# Altium schematic sheet UWB_F4_CAN_UWB_layout_R2.SchDoc
size A4; DrawnBy: Philip Rowse
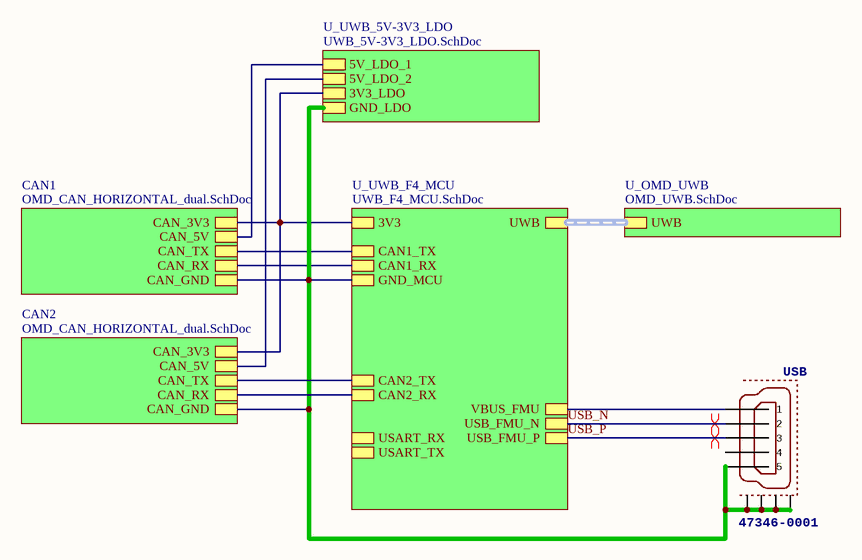
[diagram p0: UWB_F4_CAN_UWB_layout_R2.SchDoc]

## Parts
USB  47346-0001  [MOLEX-47346-0001]

## Sub-sheets
CAN1 = OMD_CAN_HORIZONTAL_dual.SchDoc: CAN_RX, CAN_TX, CAN_5V, CAN_GND, CAN_3V3
CAN2 = OMD_CAN_HORIZONTAL_dual.SchDoc: CAN_RX, CAN_TX, CAN_5V, CAN_GND, CAN_3V3
U_OMD_UWB = OMD_UWB.SchDoc: UWB (harness UWB)
U_UWB_5V-3V3_LDO = UWB_5V-3V3_LDO.SchDoc: 3V3_LDO, GND_LDO, 5V_LDO_2, 5V_LDO_1
U_UWB_F4_MCU = UWB_F4_MCU.SchDoc: GND_MCU, UWB (harness UWB), 3V3, CAN1_TX, CAN1_RX, USART_RX, USART_TX, USB_FMU_P, USB_FMU_N, VBUS_FMU, CAN2_TX, CAN2_RX

## Nets
USB_N: USB.D-(2) ; sheet U_UWB_F4_MCU/USB_FMU_N
USB_P: USB.D+(3) ; sheet U_UWB_F4_MCU/USB_FMU_P
NetUSB_GND: USB.GND(5) USB.GND1 USB.GND2 USB.GND3 USB.GND4 ; sheet U_UWB_F4_MCU/GND_MCU, sheet CAN1/CAN_GND, sheet U_UWB_5V-3V3_LDO/GND_LDO, sheet CAN2/CAN_GND
NetUSB_VBUS: USB.VBUS(1) ; sheet U_UWB_F4_MCU/VBUS_FMU
(unnamed): sheet U_UWB_F4_MCU/3V3, sheet CAN1/CAN_3V3, sheet U_UWB_5V-3V3_LDO/3V3_LDO, sheet CAN2/CAN_3V3
(unnamed): sheet U_UWB_F4_MCU/CAN1_TX, sheet CAN1/CAN_TX
(unnamed): sheet U_UWB_F4_MCU/CAN1_RX, sheet CAN1/CAN_RX
(unnamed): sheet U_UWB_F4_MCU/CAN2_TX, sheet CAN2/CAN_TX
(unnamed): sheet U_UWB_F4_MCU/CAN2_RX, sheet CAN2/CAN_RX
(unnamed): sheet CAN1/CAN_5V, sheet U_UWB_5V-3V3_LDO/5V_LDO_1
(unnamed): sheet U_UWB_5V-3V3_LDO/5V_LDO_2, sheet CAN2/CAN_5V

Not connected (* = marked no-connect by the designer): USB ID(4)

## Buses and harness runs
harness sheet U_OMD_UWB/UWB = sheet U_UWB_F4_MCU/UWB

## Layout directives
differential pair: USB_N, USB_P

## Notes on the sheet
- Title
- Size:
- Date:
- A4
- Number:
- Time:
- Revision:
- Sheet
- of
- File:

## Library data of the parts
USB = MOLEX-47346-0001: MICRO USB B, BOTTOM MOUNT; Supplier 1: Digi-Key